# EasyEDA Pro project 电压抬升.epro

# Schematic Schematic1
Board Name: Board1; Create Date: 2025-07-26
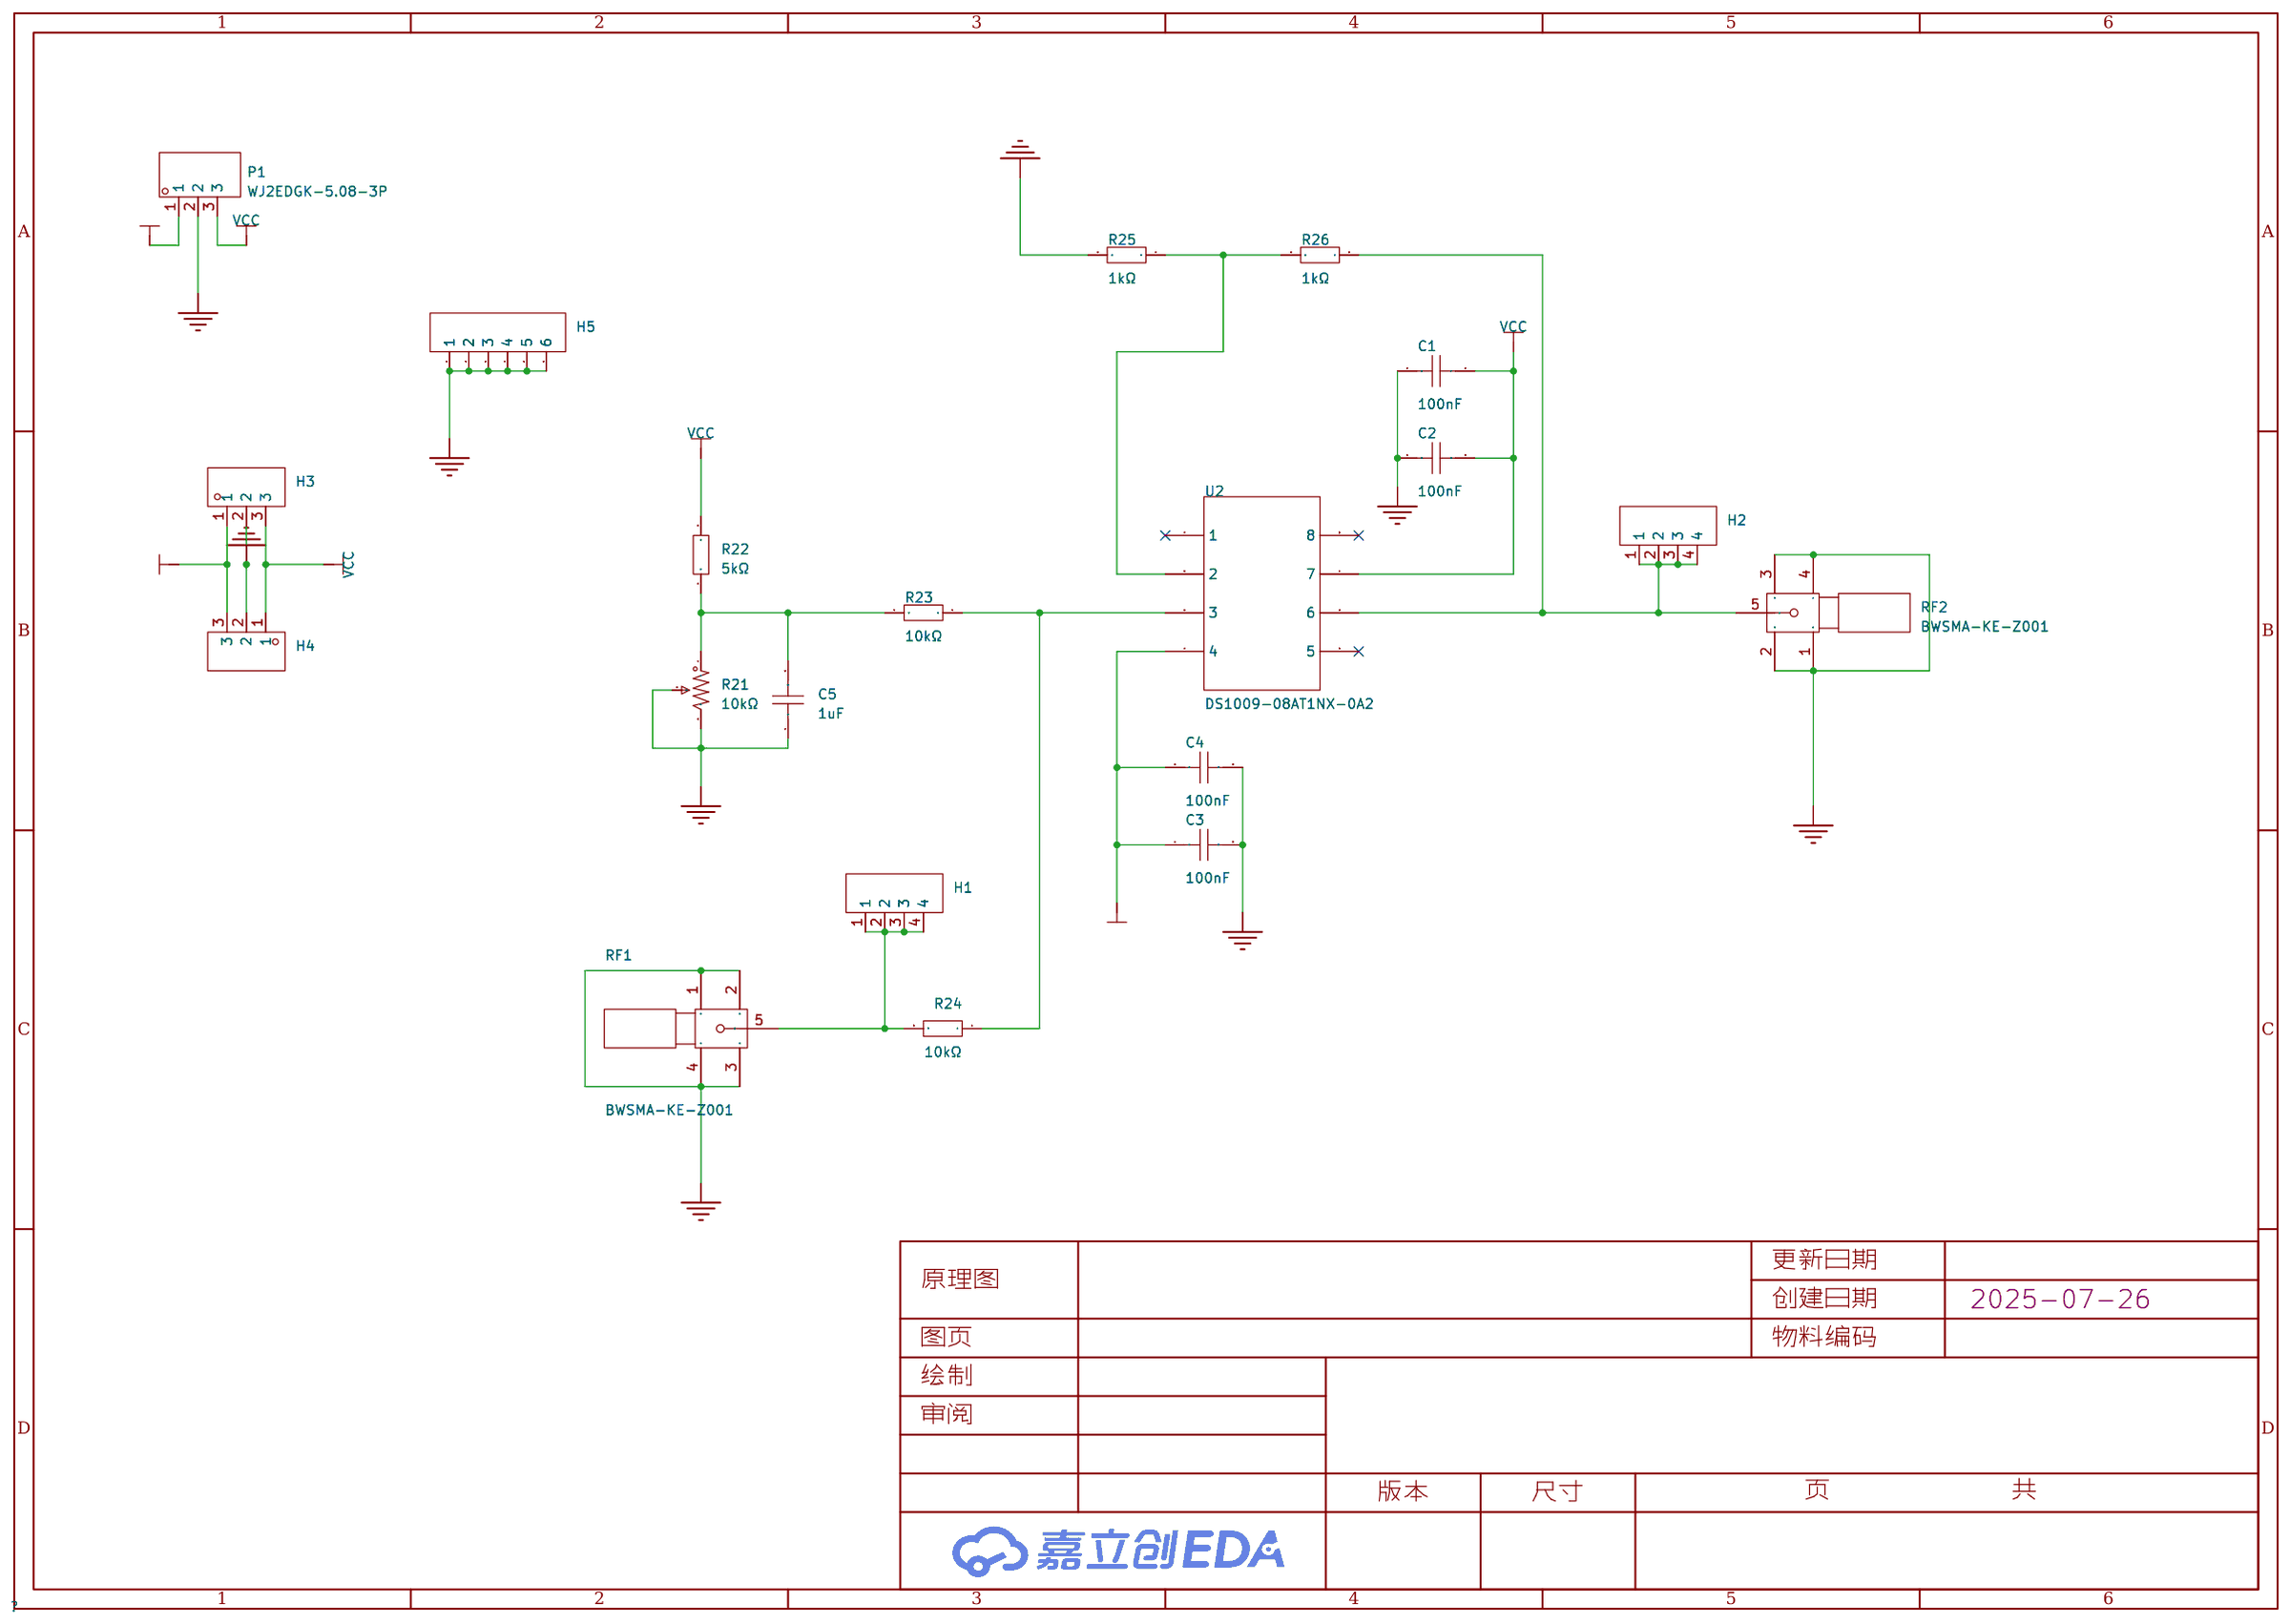
[diagram p0: schematic sheet]

## Parts
C1  100nF  [CAP-TH_L8.5-W5.0-P5.00-D1.2]
C2  100nF  [CAP-TH_L8.5-W5.0-P5.00-D1.2]
C3  100nF  [CAP-TH_L8.5-W5.0-P5.00-D1.2]
C4  100nF  [CAP-TH_L8.5-W5.0-P5.00-D1.2]
C5  1uF  [CAP-TH_L8.5-W5.0-P5.00-D1.2]
H1  -  [HDR-TH_4P-P2.54-V-M]
H2  -  [HDR-TH_4P-P2.54-V-M]
H3  -  [HDR-TH_3P-P2.54-V-M]
H4  -  [HDR-TH_3P-P2.54-V-M]
H5  -  [HDR-TH_6P-P2.54-V-M-1]
P1  WJ2EDGK-5.08-3P  [HDR-TH_3P-P5.08-V-M]
R21  10kΩ  [RES-ADJ-TH_3P-L10.0-W10.0-P2.50-L]
R22  5kΩ  [Res_1/8W]
R23  10kΩ  [Res_1/8W]
R24  10kΩ  [Res_1/8W]
R25  1kΩ  [Res_1/8W]
R26  1kΩ  [Res_1/8W]
RF1  BWSMA-KE-Z001  [SMA-TH_BWSMA-KE-Z001]
RF2  BWSMA-KE-Z001  [SMA-TH_BWSMA-KE-Z001]
U2  DS1009-08AT1NX-0A2  [DIP-8_L10.2-W10.2-P2.54-LS7.6-BL]

## Library data of the parts
C1-C5 = CT4-0805B104K500F3: 容值:100nF;精度:±10%;额定电压:50V;温度系数:X7R;; LCSC Part Name: 100nF ±10% 50V C3型（直脚）; Supplier Part: C84772; Manufacturer: FH(风华); Supplier Footprint: 插件,P=5.08mm; JLCPCB Part Class: Extended Part; Datasheet: https://atta.szlcsc.com/upload/public/pdf/source/20190402/C385200_059806A6312B28FF1421A2413EB641E1.pdf; Supplier: LCSC; Tolerance: ±10%; Voltage Rated: 50V; Temperature Coefficient: X7R
H1 H2 = HDR-M_2.54_1x4P: Supplier Part: C492403; Supplier Footprint: 插件
H3 H4 = HDR-M_2.54_1x3P: Supplier Part: C2937625; Supplier Footprint: 插件
H5 = HDR-M_2.54_1x6P: Supplier Part: C37208; Supplier Footprint: 插件
P1 = WJ2EDGK-5.08-3P: 连接器类型:公插头;固定方式:-;结构:1x3P;间距:5.08mm;颜色:-;安装方式:-;排数:1;每排PIN数:3;额定电流:20A;额定电压:450V;线规 - AWG:14~28;线规 - 平方毫米:2.5;触头材质:磷青铜;触头镀层:-;工作温度范围:-40℃~+105℃;焊接温度(最大值):-;; LCSC Part Name: 1x3P 5.08mm 排数:1 每排P数:3; Supplier Part: C71371; Manufacturer: KANGNEX(康奈克斯电气); Supplier Footprint: P=5.08mm; JLCPCB Part Class: Extended Part; Datasheet: https://atta.szlcsc.com/upload/public/pdf/source/20191225/C71371_B0E44BF9B1F530FE4C75A688EC16E5D7.pdf; Supplier: LCSC; Connector Type: 公插头; Structure: 1x3P; Pitch: 5.08mm; Number of Pins: 3P; Number of Rows: 1; Number of PINs Per Row: 3; Current Rating (Max): 20A; Voltage Rating (Max): 450V; Wire Gauge - AWG: 14~28; Wire Gauge - mm2: 2.5; Contact Material: 磷青铜; Operating Temperature Range: -40℃~+105℃; Connection Type: 螺钉连接(M2.5); Outlet Direction (Vertical Basis): 顶部出线
R21 = 3296W-1-103: 阻值:10kΩ;精度:±10%;; LCSC Part Name: 10kΩ ±10%; Supplier Part: C118954; Manufacturer: BOCHEN(博晨); Supplier Footprint: 插件; JLCPCB Part Class: 扩展库; Datasheet: https://atta.szlcsc.com/upload/public/pdf/source/20171114/C118954_15106326646611117443.pdf; Supplier: LCSC; Tolerance: ±10%
R22-R26 = Res_AXIAL-1/8W: Supplier Footprint: 轴向引线
RF1 RF2 = BWSMA-KE-Z001_C496549: 连接器类型:板端;接口类型:内孔;端口数量:1;接口直径:-;接口长度/高度:-;频率-最大值:-;射频系列:SMA;阻抗:50Ω;样式:正脚;触头材质:-;触头镀层:-;工作温度范围:-65℃~+165℃;焊接温度(最大值):-;; LCSC Part Name: 内孔 SMA 正脚; Supplier Part: C496549; Manufacturer: BAT WIRELESS(蝙蝠无线); Supplier Footprint: 插件; JLCPCB Part Class: Extended Part; Datasheet: https://atta.szlcsc.com/upload/public/pdf/source/20221228/40BF41E56A06003A0210E1785CA66EA6.pdf; Supplier: LCSC; Connector Type: 板端; Interface Type: 内孔; Number of Ports: 1; RF Series: SMA; Impedance: 50Ω; Style: 正脚; Operating Temperature Range: -65℃~+165℃
U2 = DS1009-08AT1NX-0A2: 适用IC封装类型:DIP;间距:2.54mm;行距:7.62mm;总针脚数:8P;触头镀层:锡;; LCSC Part Name: 间距2.54mm P数:8P; Supplier Part: C72124; Manufacturer: CONNFLY; Supplier Footprint: DIP-8; JLCPCB Part Class: Extended Part; Datasheet: https://atta.szlcsc.com/upload/public/pdf/source/20160429/1461922462758.pdf; Supplier: LCSC; IC Type: DIP; Pitch: 2.54mm; Row Spacing: 7.62mm; Number of Positions: 8P; Contact Plating: 锡

## Nets
GND: C1.1 C2.1 C3.2 C4.2 C5.1 H3.2 H4.2 H5.1 H5.2 H5.3 H5.4 H5.5 H5.6 P1.2 R21.2 R21.3 R25.2 RF1.1 RF1.2 RF1.3 RF1.4 RF2.1 RF2.2 RF2.3 RF2.4
VCC: C1.2 C2.2 H3.3 H4.1 P1.3 R22.2 U2.7
VEE: C3.1 C4.1 H3.1 H4.3 P1.1 U2.4
$1N785: C5.2 R21.1 R22.1 R23.2
$1N1230: H1.1 H1.2 H1.3 H1.4 R24.2 RF1.5
$1N1255: R23.1 R24.1 U2.3
$1N1352: R25.1 R26.2 U2.2
$1N1357: H2.1 H2.2 H2.3 H2.4 R26.1 RF2.5 U2.6

Not connected (* = marked no-connect by the designer): U2 1* 5* 8*

# Board PCB1
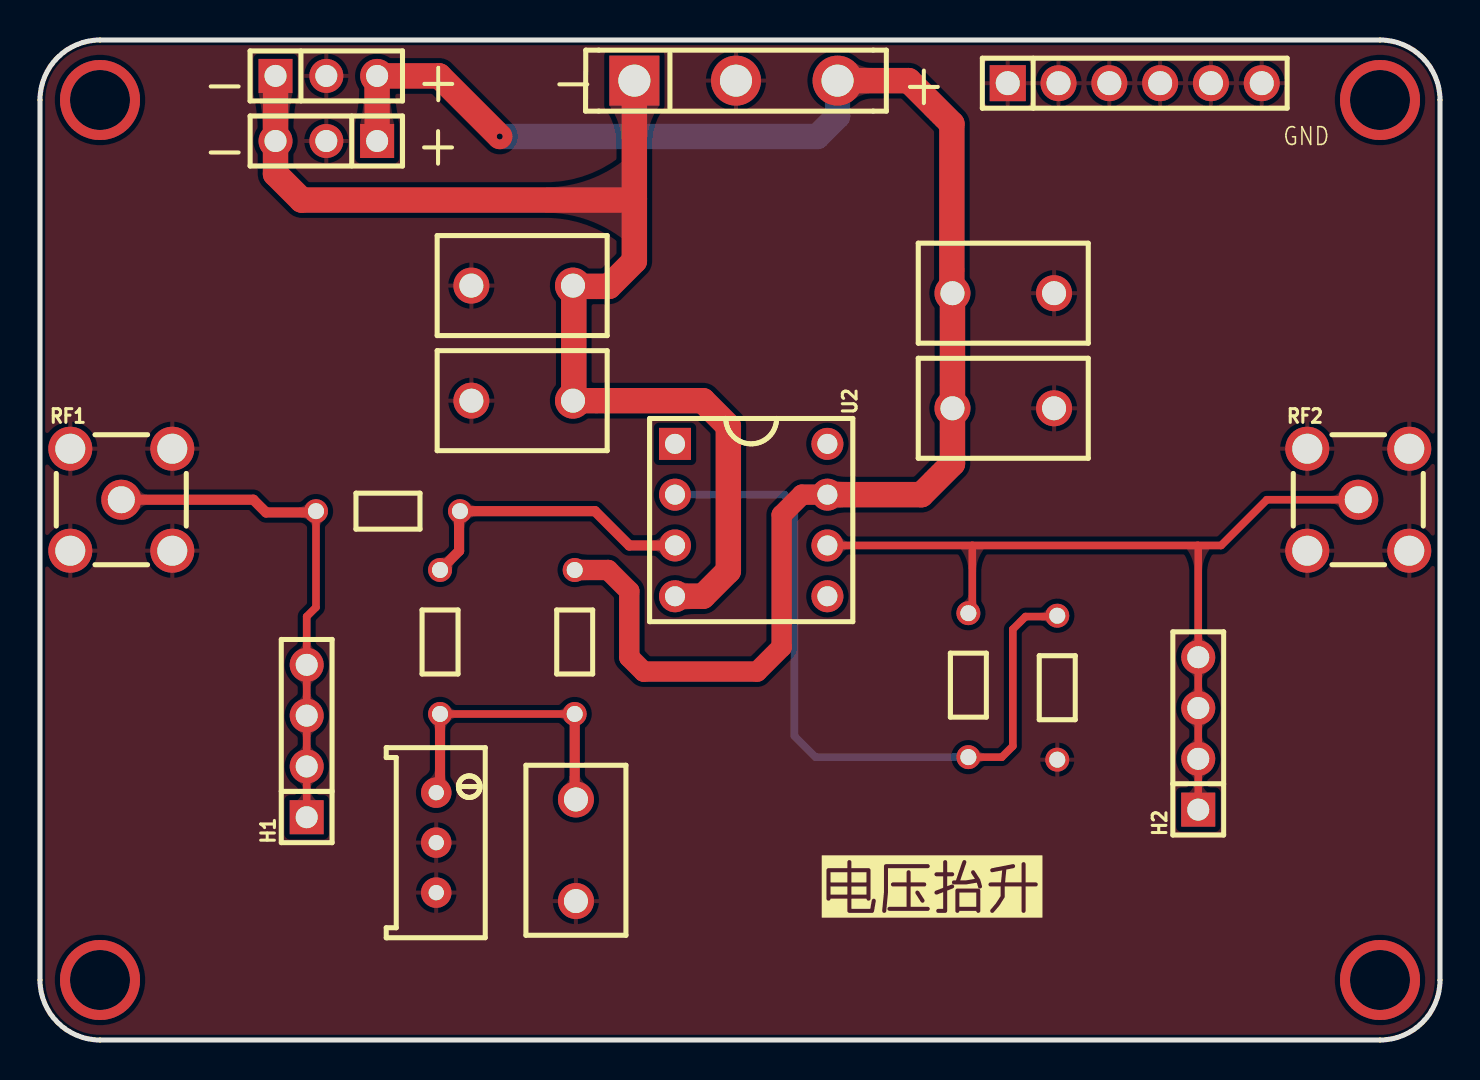
[diagram p1: board, top side]
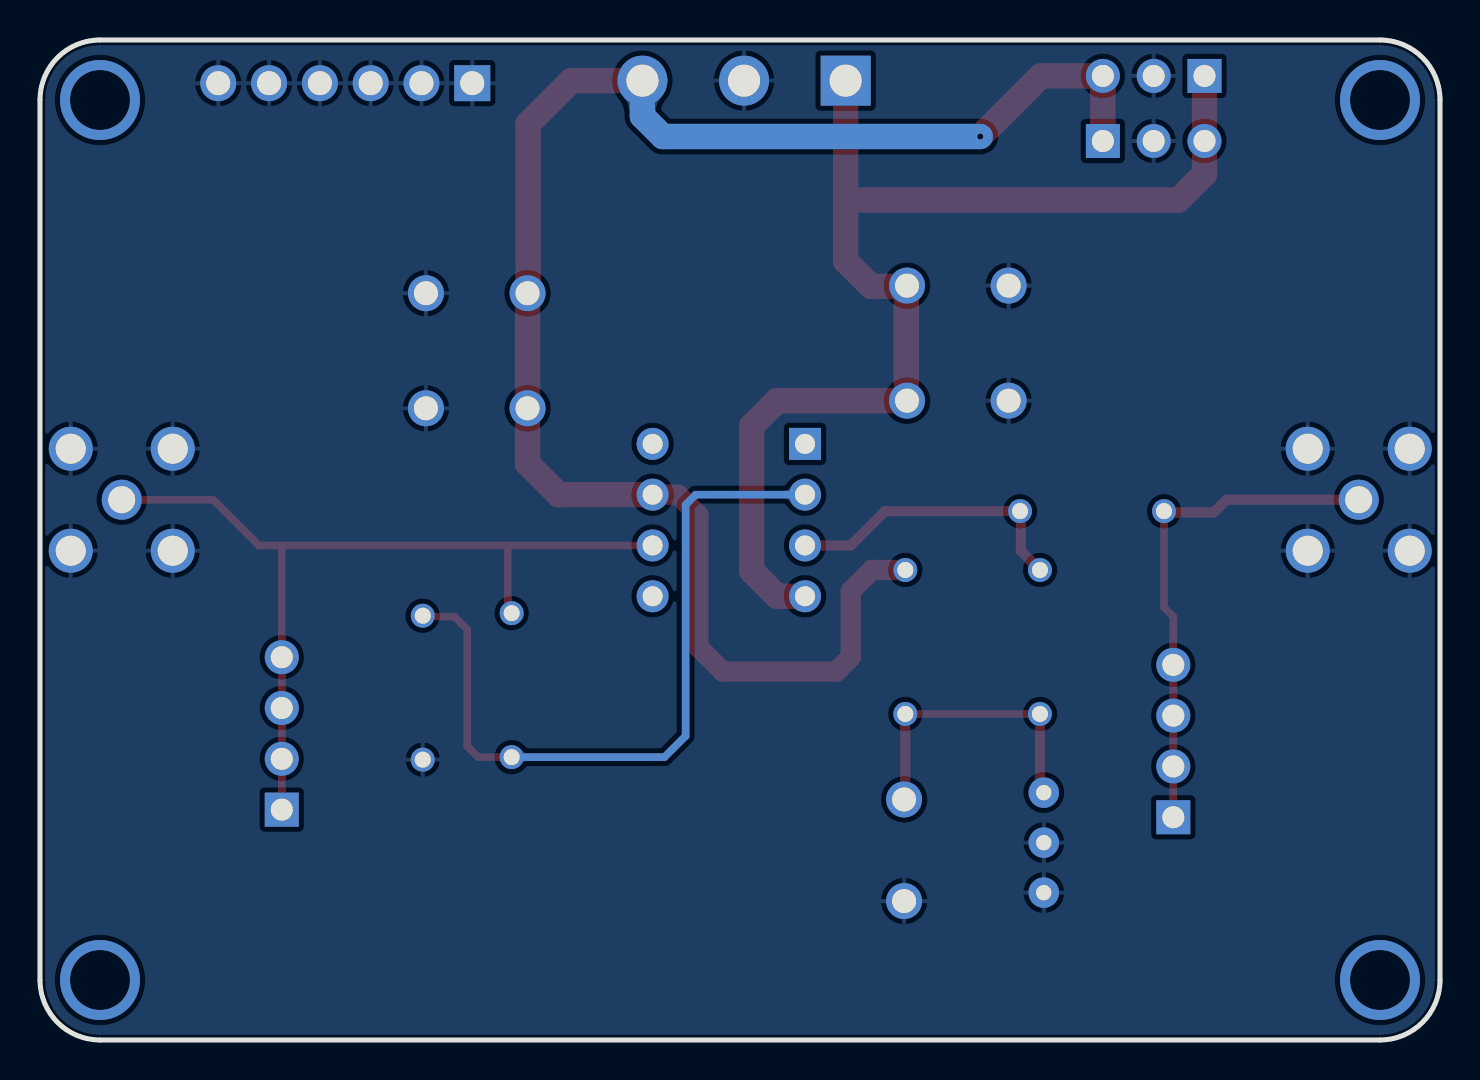
[diagram p2: board, bottom side, seen from below]

Outline 70 x 50 mm; copper layers: Top Layer, Bottom Layer. Coordinates in mm from the lower left corner of the outline.
Outline path: 0,47 0,3 arc(0.88,0.88) 3,0 67,0 arc(69.12,0.88) 70,3 70,47 arc(69.12,49.12) 67,50 3,50 arc(0.88,49.12) 0,47
Stack: Top Layer 0.035mm / Dielectric1 1.51mm FR4 er 4.5 / Bottom Layer 0.035mm

## Design rules (mm)
template: JLCPCB Capability(Two Layers Board)
spacing copperThickness1oz (default): track to track 0.102, other pairs 0.152 to 0.3
spacing copperThickness2oz: track to track 0.203, other pairs 0.152 to 0.3
track width copperThickness1oz (default): min 0.127, default 0.254, max 2.54
track width copperThickness2oz: min 0.203, default 0.254, max 2.54
differential pair differentialPair (default): width min 0.127, default 0.254, max 2.54; gap min 0.152, default 0.152
via viaSize (default): diameter min 0.5, default 0.61, max 10; hole min 0.3, default 0.305, max 6.3

## Placement (name value [footprint] x y rotation side)
C1  100nF  [CAP-TH_L8.5-W5.0-P5.00-D1.2]  48.16 31.59 180 top
C2  100nF  [CAP-TH_L8.5-W5.0-P5.00-D1.2]  48.16 37.34 180 top
C3  100nF  [CAP-TH_L8.5-W5.0-P5.00-D1.2]  24.11 37.72 180 top
C4  100nF  [CAP-TH_L8.5-W5.0-P5.00-D1.2]  24.11 31.97 180 top
C5  1uF  [CAP-TH_L8.5-W5.0-P5.00-D1.2]  26.8 9.49 90 top
H1  -  [HDR-TH_4P-P2.54-V-M]  13.33 14.95 90 top
H2  -  [HDR-TH_4P-P2.54-V-M]  57.91 15.33 90 top
H3  -  [HDR-TH_3P-P2.54-V-M]  14.32 48.2 0 top
H4  -  [HDR-TH_3P-P2.54-V-M]  14.32 44.95 180 top
H5  -  [HDR-TH_6P-P2.54-V-M-1]  54.74 47.84 0 top
P1  WJ2EDGK-5.08-3P  [HDR-TH_3P-P5.08-V-M]  34.8 47.97 0 top
R21  10kΩ  [RES-ADJ-TH_3P-L10.0-W10.0-P2.50-L]  19.81 9.87 270 top
R22  5kΩ  [Res_1/8W]  26.8 19.9 90 top
R23  10kΩ  [Res_1/8W]  19.94 19.9 270 top
R24  10kΩ  [Res_1/8W]  17.4 26.5 180 top
R25  1kΩ  [Res_1/8W]  50.8 17.61 270 top
R26  1kΩ  [Res_1/8W]  46.35 17.74 270 top
RF1  BWSMA-KE-Z001  [SMA-TH_BWSMA-KE-Z001]  4.06 27.01 0 top
RF2  BWSMA-KE-Z001  [SMA-TH_BWSMA-KE-Z001]  65.91 27.01 0 top
U2  DS1009-08AT1NX-0A2  [DIP-8_L10.2-W10.2-P2.54-LS7.6-BL]  35.56 26 270 top

## Footprints (pads in the part's own frame, mm; a bottom-side part is the same pattern mirrored in y, then rotated)
CAP-TH_L8.5-W5.0-P5.00-D1.2
  round 1.8 hole 1.2: 1(-2.54,0) 2(2.54,0)
DIP-8_L10.2-W10.2-P2.54-LS7.6-BL
  rect 1.6x1.6 hole 1: 1(-3.808,-3.81)
  round 1.6 hole 1: 2(-1.27,-3.81) 3(1.27,-3.81) 4(3.81,-3.81) 5(3.81,3.81) 6(1.27,3.81) 7(-1.27,3.81) 8(-3.81,3.81)
HDR-TH_3P-P2.54-V-M
  rect 1.7x1.7 hole 1.1: 1(-2.54,0)
  round 1.7 hole 1.1: 2(0,0) 3(2.54,0)
HDR-TH_3P-P5.08-V-M
  rect 2.5x2.5 hole 1.6: 1(-5.08,0)
  round 2.5 hole 1.6: 2(0,0) 3(5.08,0)
HDR-TH_4P-P2.54-V-M
  rect 1.7x1.7 hole 1.1: 1(-3.81,0)
  round 1.7 hole 1.1: 2(-1.27,0) 3(1.27,0) 4(3.81,0)
HDR-TH_6P-P2.54-V-M-1
  rect 1.8x1.8 hole 1.2: 1(-6.35,0)
  round 1.8 hole 1.2: 2(-3.81,0) 3(-1.27,0) 4(1.27,0) 5(3.81,0) 6(6.35,0)
RES-ADJ-TH_3P-L10.0-W10.0-P2.50-L
  round 1.524 hole 0.762: 1(-2.5,0) 2(0,0) 3(2.5,0)
Res_1/8W
  round 1.199 hole 0.8: 1(-3.599,0.063) 2(3.599,0.063)
SMA-TH_BWSMA-KE-Z001
  round 2.2 hole 1.5: 1(-2.55,-2.55) 2(-2.55,2.55) 3(2.55,2.55) 4(2.55,-2.55)
  round 2 hole 1.35: 5(0,0)

## Nets
As in the schematic.

Pads without a net: U2 1 5 8

## Via types
v1: diameter 4, hole 3, Top Layer to Bottom Layer, 4 vias
v2: diameter 0.61, hole 0.305, Top Layer to Bottom Layer, 1 via

## Routing (per net, layer and track width the routed paths; a pad name or vN(x,y) marks a point on that pad's centre or on a via; arc(x,y) is an arc through that point)
VCC: length 84.4
  Top Layer w1.016: U2.7 38.1,27.27 37.08,26.25 37.08,19.65 35.86,18.42 30.18,18.42 29.46,19.14 29.46,22.44 28.41,23.5 R22.2
  Top Layer w1.27: U2.7 44.07,27.27 45.62,28.82 C1.2 C2.2 45.59,37.37 45.59,45.81 43.43,47.97 P1.3 ; v2(22.99,45.17) 19.96,48.2 H3.3 H4.1
  Bottom Layer w1.27: P1.3 39.88,46.19 38.86,45.17 v2(22.99,45.17)
VEE: length 60.5
  Top Layer w1.27: 29.72,42.06 29.66,42 13.08,42 11.78,43.3 H4.3 H3.1 ; 29.72,42.06 29.72,38.95 28.45,37.68 26.69,37.68 ; 29.72,42.06 P1.1 ; 26.69,37.68 C3.1 ; 26.69,37.68 26.69,32 C4.1 33.15,31.97 34.42,30.7 34.42,23.46 33.15,22.19 U2.4
(no net):
  vias: v1(3,47) v1(3,3) v1(67,47) v1(67,3)
$1N785: length 15
  Top Layer w0.381: R23.2 R22.1
  Top Layer w0.508: R22.1 26.73,12.09 C5.2 ; R23.2 20,12.56 R21.1
$1N1230: length 25.5
  Top Layer w0.381: R24.2 13.8,21.64 13.33,21.17 H1.4 H1.3 H1.2 H1.1
  Top Layer w0.508: RF1.5 10.67,27.01 11.3,26.38 13.74,26.38 R24.2
$1N1255: length 14.8
  Top Layer w0.508: R23.1 20.96,24.45 20.96,26.4 R24.1 27.75,26.44 29.46,24.73 U2.3
$1N1352: length 37.7
  Top Layer w0.381: R26.2 48.09,14.14 48.64,14.69 48.64,20.54 49.28,21.17 50.82,21.17 R25.1
  Bottom Layer w0.381: U2.2 37.21,27.27 37.72,26.76 37.72,15.2 38.78,14.14 R26.2
$1N1357: length 44.2
  Top Layer w0.381: 57.89,24.73 59.06,24.73 61.34,27.01 RF2.5 ; 57.89,24.73 46.62,24.73 ; 57.89,24.73 57.91,24.7 H2.4 H2.2 57.91,11.52 ; 46.62,24.73 U2.6 ; 46.62,24.73 46.62,21.54 46.42,21.34

## Copper pours and planes (outline as drawn; the poured copper is in the pictures)
GND on Top Layer: -3.56,52.41 77.34,52.41 77.34,-5.37 -3.56,-5.37
GND on Bottom Layer: -5.72,54.19 81.15,54.19 81.15,-11.21 -5.72,-11.21

Small or netless copper shapes (teardrops, artwork), in the pictures only: 53 on Top Layer, 3 on Bottom Layer

## Text on the board
Top Silkscreen Layer: GND | - | + | 电压抬升
